# Altium schematic sheet ConversorSigmaDelta.SchDoc
size A4
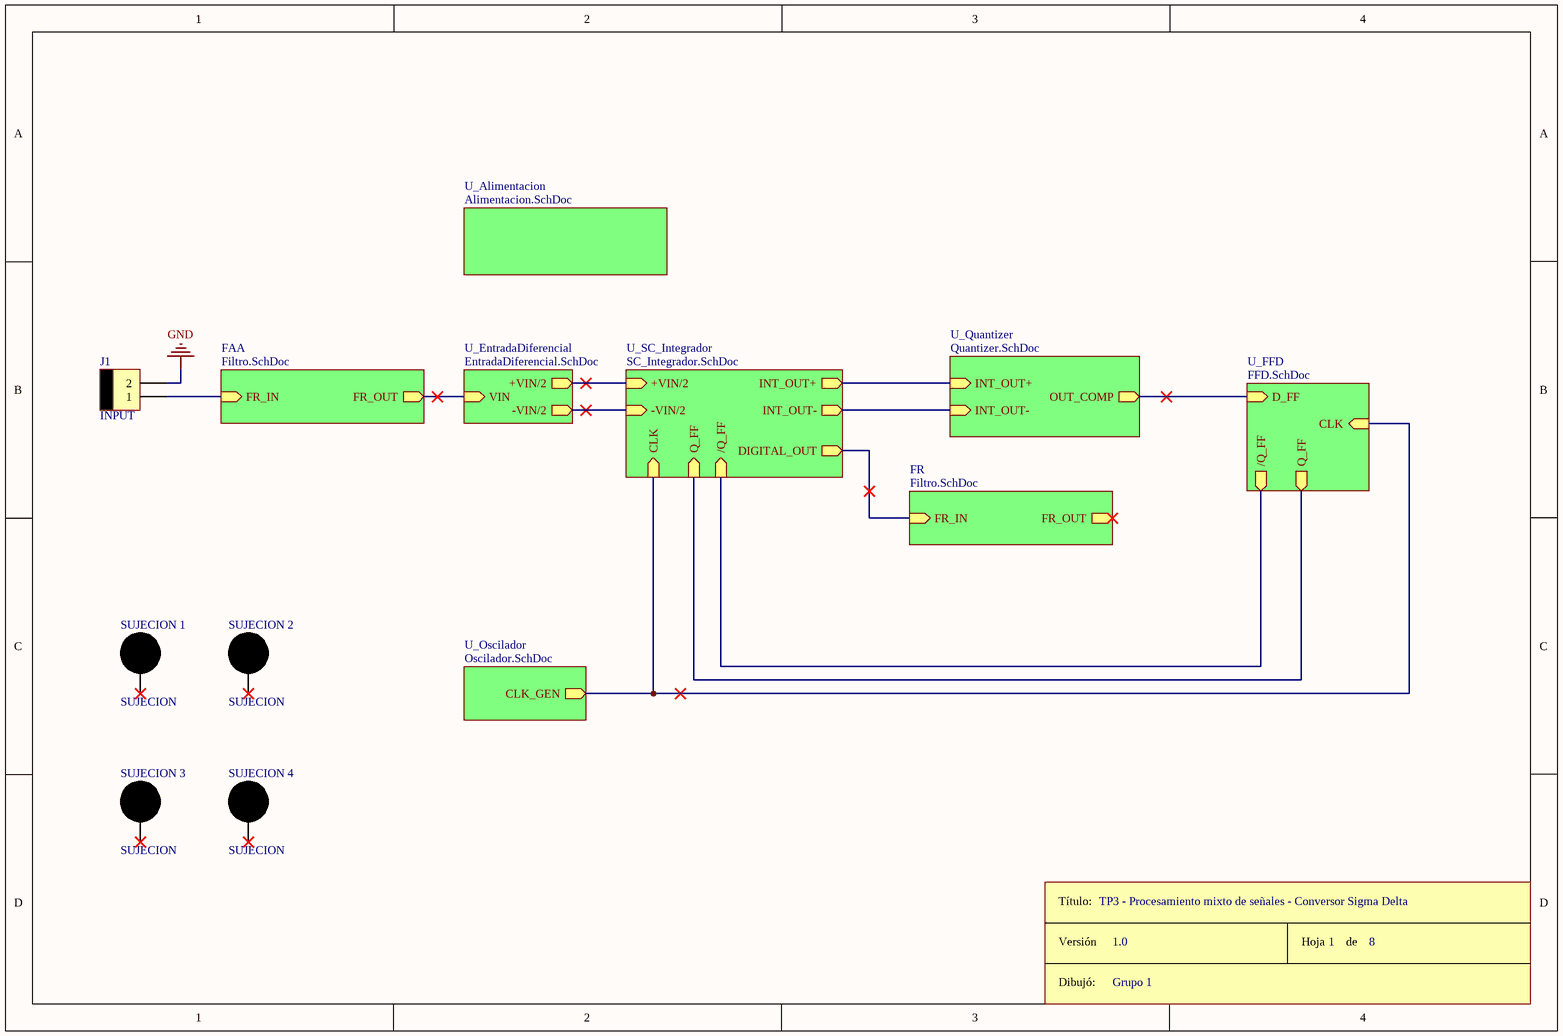
[diagram p0: ConversorSigmaDelta.SchDoc]

## Parts
J1  INPUT  [MOLEX2]
ROT6  Rótulo  (value not drawn)
SUJECION_1  SUJECION  [SUJECION (5.00MM - 3.50MM)]
SUJECION_2  SUJECION  [SUJECION (5.00MM - 3.50MM)]
SUJECION_3  SUJECION  [SUJECION (5.00MM - 3.50MM)]
SUJECION_4  SUJECION  [SUJECION (5.00MM - 3.50MM)]

## Sub-sheets
FAA = Filtro.SchDoc: FR_IN (in), FR_OUT (out)
FR = Filtro.SchDoc: FR_IN (in), FR_OUT (out)
U_Alimentacion = Alimentacion.SchDoc: no entries
U_EntradaDiferencial = EntradaDiferencial.SchDoc: +VIN/2 (out), -VIN/2 (out), VIN (in)
U_FFD = FFD.SchDoc: D_FF (in), CLK (in), Q_FF (out), /Q_FF (out)
U_Oscilador = Oscilador.SchDoc: CLK_GEN (out)
U_Quantizer = Quantizer.SchDoc: OUT_COMP (out), INT_OUT+ (in), INT_OUT- (in)
U_SC_Integrador = SC_Integrador.SchDoc: INT_OUT+ (out), INT_OUT- (out), Q_FF (in), +VIN/2 (in), /Q_FF (in), -VIN/2 (in), CLK (in), DIGITAL_OUT (out)

## Nets
GND: J1.2
NetJ1_1: J1.1 ; sheet FAA/FR_IN
(unnamed): sheet U_EntradaDiferencial/+VIN/2, sheet U_SC_Integrador/+VIN/2
(unnamed): sheet U_EntradaDiferencial/-VIN/2, sheet U_SC_Integrador/-VIN/2
(unnamed): sheet U_EntradaDiferencial/VIN, sheet FAA/FR_OUT
(unnamed): sheet U_SC_Integrador/INT_OUT+, sheet U_Quantizer/INT_OUT+
(unnamed): sheet U_SC_Integrador/INT_OUT-, sheet U_Quantizer/INT_OUT-
(unnamed): sheet U_SC_Integrador/Q_FF, sheet U_FFD/Q_FF
(unnamed): sheet U_SC_Integrador//Q_FF, sheet U_FFD//Q_FF
(unnamed): sheet U_SC_Integrador/CLK, sheet U_FFD/CLK, sheet U_Oscilador/CLK_GEN
(unnamed): sheet U_SC_Integrador/DIGITAL_OUT, sheet FR/FR_IN
(unnamed): sheet U_Quantizer/OUT_COMP, sheet U_FFD/D_FF

Not connected (* = marked no-connect by the designer): SUJECION_1 1*; SUJECION_2 1*; SUJECION_3 1*; SUJECION_4 1*

## Notes on the sheet
- TP3 - Procesamiento mixto de señales - Conversor Sigma Delta
- 1.0
- Grupo 1
- 1
- 8
- (in symbol Rótulo) Título:; Versión; Hoja       de; Dibujó:

## Library data of the parts
J1 = MOLEX2